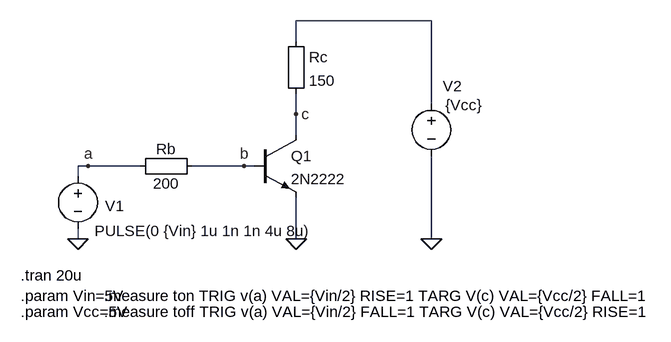
[diagram p0: schematic BJT-SWITCH-exp.asc]
BJT-SWITCH-exp.asc, the LTspice schematic file:
Version 4
SHEET 1 880 680
WIRE 416 -96 208 -96
WIRE 208 -64 208 -96
WIRE 416 32 416 -96
WIRE 208 48 208 16
WIRE 208 80 208 48
WIRE -112 128 -128 128
WIRE -32 128 -112 128
WIRE 128 128 48 128
WIRE 144 128 128 128
WIRE -128 144 -128 128
WIRE -128 240 -128 224
WIRE 208 240 208 176
WIRE 416 240 416 112
FLAG 208 240 0
FLAG -128 240 0
FLAG 416 240 0
FLAG -112 128 a
FLAG 208 48 c
FLAG 128 128 b
SYMBOL Misc\\EuropeanResistor 192 -80 R0
SYMATTR InstName Rc
SYMATTR Value 150
SYMBOL Misc\\EuropeanResistor 64 112 R90
WINDOW 0 5 56 VBottom 2
WINDOW 3 27 56 VTop 2
SYMATTR InstName Rb
SYMATTR Value 200
SYMBOL voltage -128 128 R0
WINDOW 3 26 100 Left 2
WINDOW 123 0 0 Left 2
WINDOW 39 0 0 Left 2
WINDOW 0 42 61 Left 2
SYMATTR Value PULSE(0 {Vin} 1u 1n 1n 4u 8u)
SYMATTR InstName V1
SYMBOL voltage 416 16 R0
WINDOW 3 22 18 Left 2
WINDOW 123 0 0 Left 2
WINDOW 39 0 0 Left 2
WINDOW 0 18 -11 Left 2
SYMATTR Value {Vcc}
SYMATTR InstName V2
SYMBOL npn 144 80 R0
SYMATTR InstName Q1
SYMATTR Value 2N2222
TEXT -216 296 Left 2 !.tran 20u
TEXT -216 328 Left 2 !.param Vin=5V
TEXT -88 352 Left 2 !.measure toff TRIG v(a) VAL={Vin/2} FALL=1 TARG V(c) VAL={Vcc/2} RISE=1
TEXT -216 352 Left 2 !.param Vcc=5V
TEXT -88 328 Left 2 !.measure ton TRIG v(a) VAL={Vin/2} RISE=1 TARG V(c) VAL={Vcc/2} FALL=1

The netlist it stands for:
* BJT-SWITCH-exp.asc
Rc N001 c 150
Rb b a 200
V1 a 0 PULSE(0 {Vin} 1u 1n 1n 4u 8u)
V2 N001 0 {Vcc}
Q1 c b 0 0 2N2222
.model NPN NPN
.model PNP PNP
.lib standard.bjt
.tran 20u
.param Vin=5V
.measure toff TRIG v(a) VAL={Vin/2} FALL=1 TARG V(c) VAL={Vcc/2} RISE=1
.param Vcc=5V
.measure ton TRIG v(a) VAL={Vin/2} RISE=1 TARG V(c) VAL={Vcc/2} FALL=1
.backanno
.end